# Altium schematic sheet hv_architecture.SchDoc
size B; SheetNumber: 3
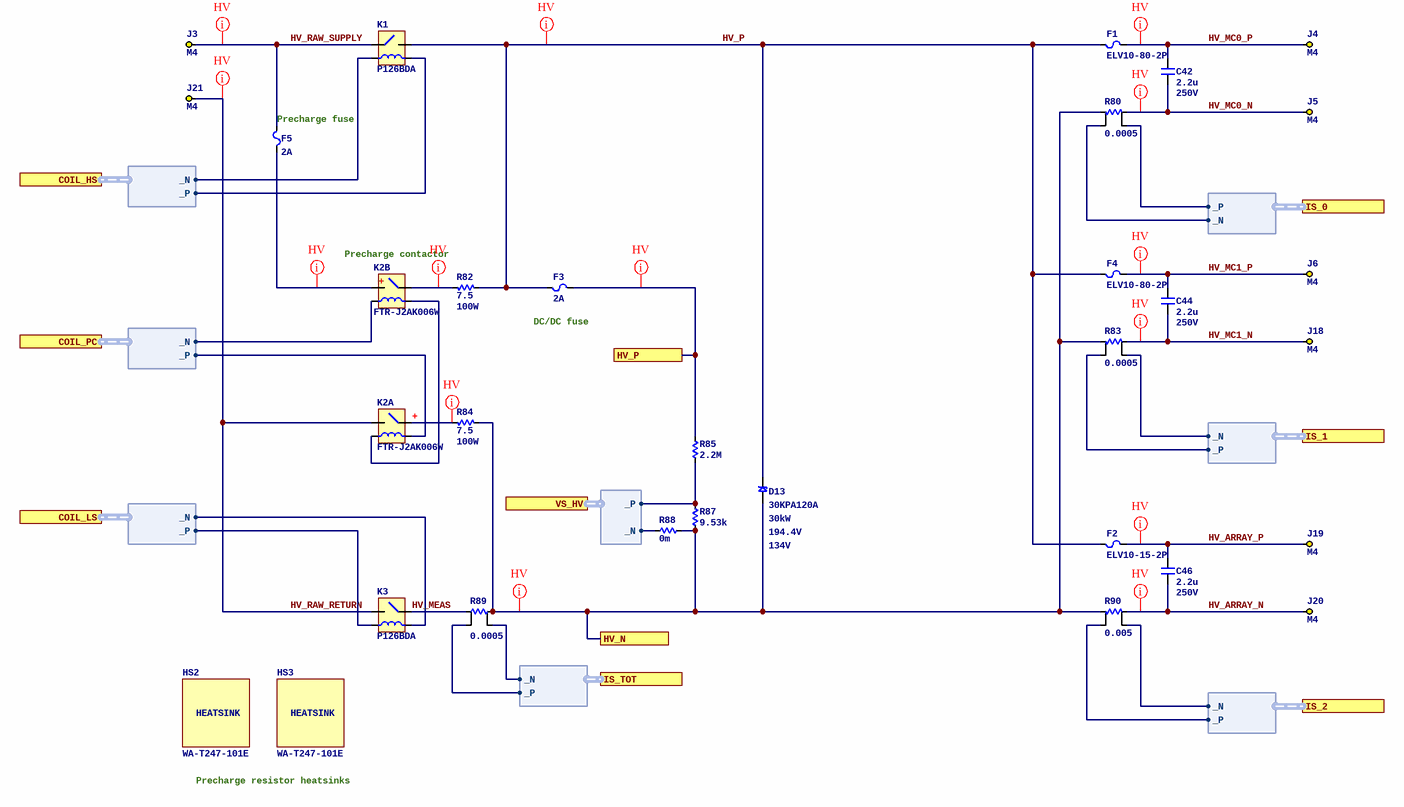
[diagram p0: hv_architecture.SchDoc]

## Parts
C42  Capacitance: 2.2u  Voltage Rating: 250V  [C2220]  (hidden comment: C5750X7T2E225KT000N)
C44  Capacitance: 2.2u  Voltage Rating: 250V  [C2220]  (hidden comment: C5750X7T2E225KT000N)
C46  Capacitance: 2.2u  Voltage Rating: 250V  [C2220]  (hidden comment: C5750X7T2E225KT000N)
D13  30KPA120A  Non-rep Peak Rev Power Dis-Max: 30kW  Clamping Voltage-Max: 194.4V  Min Breakdown Voltage: 134V  [P600_VERTICAL]
F1  ELV10-80-2P  [EATON_ELV10-xx-2P]
F2  ELV10-15-2P  [EATON_ELV10-xx-2P]
F3  Current: 2A  [BELFUSE_0ZRE0200FF]  (hidden comment: 0ZRE0200FF1A)
F4  ELV10-80-2P  [EATON_ELV10-xx-2P]
F5  Current: 2A  [BELFUSE_0ZRE0200FF]  (hidden comment: 0ZRE0200FF1A)
HS2  WA-T247-101E  (mechanical)
HS3  WA-T247-101E  (mechanical)
J3  Thread Size: M4  [WURTH_TERM_7461086]  (hidden comment: 7461086)
J4  Thread Size: M4  [WURTH_TERM_7461086]  (hidden comment: 7461086)
J5  Thread Size: M4  [WURTH_TERM_7461086]  (hidden comment: 7461086)
J6  Thread Size: M4  [WURTH_TERM_7461086]  (hidden comment: 7461086)
J18  Thread Size: M4  [WURTH_TERM_7461086]  (hidden comment: 7461086)
J19  Thread Size: M4  [WURTH_TERM_7461086]  (hidden comment: 7461086)
J20  Thread Size: M4  [WURTH_TERM_7461086]  (hidden comment: 7461086)
J21  Thread Size: M4  [WURTH_TERM_7461086]  (hidden comment: 7461086)
K1  P126BDA  [RELAY_P126]
K2  FTR-J2AK006W  [RELAY_FTR-J2]  (parts A,B of 2)
K3  P126BDA  [RELAY_P126]
R80  Resistance (Ohms): 0.0005  [VISHAY_WSL2726]  (hidden comment: WSL2726L5000FEB)
R82  Resistance (Ohms): 7.5  Power (Watts): 100W  [TO-247-2 w Ohmite heatsink]  (hidden comment: TEH100M7R50FE)
R83  Resistance (Ohms): 0.0005  [VISHAY_WSL2726]  (hidden comment: WSL2726L5000FEB)
R84  Resistance (Ohms): 7.5  Power (Watts): 100W  [TO-247-2 w Ohmite heatsink]  (hidden comment: RES_7.5_OHM_100W_1%_TO247)
R85  value 2.2M  [R1206]  (hidden comment: RC1206FR-072M2L)
R87  value 9.53k  [R0402]  (hidden comment: 0402WGF9531TCE)
R88  value 0m  [R0402]  (hidden comment: 0402WGF0000TCE)
R89  Resistance (Ohms): 0.0005  [VISHAY_WSL2726]  (hidden comment: WSL2726L5000FEB)
R90  Resistance (Ohms): 0.005  [VISHAY_WSL2726]  (hidden comment: WSL27265L000FEB)

## Ports
COIL_HS (harness DIFF), COIL_LS (harness DIFF), COIL_PC (harness DIFF), HV_N, HV_P, IS_0 (harness DIFF), IS_1 (harness DIFF), IS_2 (harness DIFF), IS_TOT (harness DIFF), VS_HV (harness DIFF)

## Harnesses
DIFF: _N, _P

## Nets
HV_ARRAY_N: C46.2 J20.0 R90.1
HV_ARRAY_P: C46.1 F2.2 J19.0
HV_MC0_N: C42.2 J5.0 R80.1
HV_MC0_P: C42.1 F1.2 J4.0
HV_MC1_N: C44.2 J18.0 R83.1
HV_MC1_P: C44.1 F4.2 J6.0
HV_MEAS: K3.4 R89.1
HV_N: D13.1 R80.2 R83.2 R84.2 R87.2 R88.2 R89.2 R90.2 ; port HV_N
HV_P: D13.2 F1.1 F2.1 F3.1 F4.1 K1.3 R82.2
HV_P: F3.2 R85.1 ; port HV_P  [a separate net that carries the same name]
HV_RAW_RETURN: J21.0 K2.6 K3.3
HV_RAW_SUPPLY: F5.1 J3.0 K1.4
NetF5_2: F5.2 K2.8
NetK1_1: K1.1 ; port COIL_HS._N
NetK1_2: K1.2 ; port COIL_HS._P
NetK2_1: K2.1 ; port COIL_PC._P
NetK2_2: K2.2 K2.3
NetK2_4: K2.4 ; port COIL_PC._N
NetK2_5: K2.5 R84.1
NetK2_7: K2.7 R82.1
NetK3_1: K3.1 ; port COIL_LS._N
NetK3_2: K3.2 ; port COIL_LS._P
NetR80_3: R80.3 ; port IS_0._P
NetR80_4: R80.4 ; port IS_0._N
NetR83_3: R83.3 ; port IS_1._N
NetR83_4: R83.4 ; port IS_1._P
NetR85_2: R85.2 R87.1 ; port VS_HV._P
NetR88_1: R88.1 ; port VS_HV._N
NetR89_3: R89.3 ; port IS_TOT._P
NetR89_4: R89.4 ; port IS_TOT._N
NetR90_3: R90.3 ; port IS_2._N
NetR90_4: R90.4 ; port IS_2._P

## Layout directives
net class HV: HV_ARRAY_N, HV_ARRAY_P, HV_MC0_N, HV_MC0_P, HV_MC1_N, HV_MC1_P, HV_N, HV_P, HV_RAW_RETURN, HV_RAW_SUPPLY, NetF5_2, NetK2_5, NetK2_7

## Notes on the sheet
- (near F5) Precharge fuse
- Precharge contactor
- (near F3) DC/DC fuse
- Precharge resistor heatsinks
- (in symbol HEATSINK_OHMITE_WA-T247-101E) HEATSINK
- (in symbol RELAY_FTR-J2AK006W, part A) +
- (in symbol RELAY_FTR-J2AK006W, part B) +

## Library data of the parts
C42 C44 C46 = C5750X7T2E225KT000N: Manufacturer: TDK; Dielectric: X7T; ComponentLink1URL: https://wmsc.lcsc.com/wmsc/upload/file/pdf/v2/lcsc/2304140030_TDK-C5750X7T2E225KT000N_C435266.pdf; ComponentLink1Description: Datasheet; Manufacturer Part Number: C5750X7T2E225KT000N; Package: 2220; Supplier 2: LCSC; Supplier Part Number 2: C435266
D13 = TVS_UNI_30KPA120A: Trans Voltage Suppressor Diode, 30000W, 120V V(RWM), Unidirectional, 1 Element, Silicon; Manufacturer: Littelfuse; Supplier 1: Digikey; Supplier Part Number 1: 30KPA120A-ND; Manufacturer Part Number: 30KPA120A; ComponentLink1URL: https://mm.digikey.com/Volume0/opasdata/d220001/medias/docus/4180/30KPA_Series.pdf; ComponentLink1Description: Datasheet; Supplier 2: LCSC; Supplier Part Number 2: C1984717
F1 F4 = FUSE_EATON_ELV10-80-2P: FUSE EV 80A 200VDC 2P TERM; Manufacturer: Eaton; Supplier 1: Digikey; Supplier Part Number 1: 283-ELV10-80-2P-ND; Manufacturer Part Number: ELV10-80-2P; ComponentLink1Description: Datasheet; ComponentLink1URL: https://www.eaton.com/content/dam/eaton/products/electronic-components/resources/data-sheet/eaton-elv10-10x25mm-ev-fuse-data-sheet-elx1302-en.pdf
F2 = FUSE_EATON_ELV10-15-2P: 15A 200 VDC Fuse Cartridge Through Hole; Manufacturer: Eaton; Supplier 1: Digikey; Supplier Part Number 1: 283-ELV10-15-2P-ND; Manufacturer Part Number: ELV10-15-2P; ComponentLink1Description: Datasheet; ComponentLink1URL: https://www.eaton.com/content/dam/eaton/products/electronic-components/resources/data-sheet/eaton-elv10-10x25mm-ev-fuse-data-sheet-elx1302-en.pdf
F3 F5 = PTC_BELFUSE_0ZRE0200FF1A: Polymeric PTC Resettable Fuse 240V 2 A Ih Through Hole Radial, Disc; Manufacturer: Bel Fuse Inc.; Supplier 1: Digikey; Supplier Part Number 1: 5923-0ZRE0200FF1A-ND; Manufacturer Part Number: 0ZRE0200FF1A; Supplier 2: LCSC; ComponentLink1Description: Datasheet; ComponentLink1URL: https://www.belfuse.com/media/datasheets/products/circuit-protection/ds-cp-0zre-series.pdf
HS2 HS3 = HEATSINK_OHMITE_WA-T247-101E: Heat Sink, 11ohm, Extruded, Clip, Longitudinal, Aluminum Alloy, Anodized; Manufacturer: Ohmite; Supplier 1: Digikey; Supplier Part Number 1: WA-T247-101E-ND; Manufacturer Part Number: WA-T247-101E; ComponentLink1Description: Datasheet; ComponentLink1URL: https://www.ohmite.com/assets/images/sink-w.pdf
J3-J6 J18-J21 = CONN_WURTH_7461086: POWER ELEMENT BUSH M4 12PIN; Manufacturer: Wurth Electronics; Supplier 1: Digikey; Supplier Part Number 1: 732-3207-ND; Manufacturer Part Number: 7461086
K1 K3 = RELAY_P126BDA: RELAY GEN PURPOSE SPST 60A 12V; Manufacturer: Sensata; Supplier 1: Digikey; Supplier Part Number 1: 3596-P126BDA-ND; Manufacturer Part Number: P126BDA; Supplier 2: Mouser; Supplier Part Number 2: 682-P126BDA; ComponentLink1Description: Datasheet; ComponentLink1URL: https://www.sensata.com/sites/default/files/a/sensata-gigavac-p126-series-minitactor-contactors-datasheet.pdf
K2 = RELAY_FTR-J2AK006W: General Purpose Relay 450VDC/10A; Manufacturer: Fujitsu; Supplier 1: Verical; Supplier Part Number 1: FTR-J2AK006W; Manufacturer Part Number: FTR-J2AK006W; ComponentLink1URL: https://www.fcl-components.com/downloads/MICRO/fcai/relays/ftr-j2.pdf; ComponentLink1Description: Datasheet; Supplier 2: Mouser; Supplier Part Number 2: 817-FTR-J2AK006W
R80 R83 R89 = RES_CURRENT_SENSE_0.0005_OHM_1%_3W_2726_WSL2726L5000FEB: RES SMD 0.0005 OHM 1% 3W 2726; Manufacturer: Vishay Dale; Supplier 1: Digikey; Manufacturer Part Number: WSL2726L5000FEB; ComponentLink1URL: http://www.vishay.com/docs/30131/wsl2726.pdf; ComponentLink1Description: Datasheet; Supplier Part Number 1: WSLQ-.0005CT-ND; Supplier 2: LCSC; Supplier Part Number 2: C4132421
R82 = RES_7.5_OHM_100W_1%_TO247: RES TK FM 7.5 OHM 100W 1% TO247; Manufacturer: Ohmite; Supplier 1: Digikey; Manufacturer Part Number: TEH100M7R50FE; ComponentLink1URL: http://www.ohmite.com/cat/res_teh100.pdf; ComponentLink1Description: Datasheet; Supplier Part Number 1: TEH100M7R50FE-ND; Supplier 2: LCSC; Supplier Part Number 2: C2641795
R84 = RES_7.5_OHM_100W_1%_TO247: RES TK FM 7.5 OHM 100W 1% TO247; Manufacturer: Ohmite; Manufacturer Part Number: TEH100M7R50FE; Supplier 1: Digikey; ComponentLink1URL: http://www.ohmite.com/cat/res_teh100.pdf; ComponentLink1Description: Datasheet; Supplier Part Number 1: TEH100M7R50FE-ND; Supplier 2: LCSC; Supplier Part Number 2: C2641795
R85 = RC1206FR-072M2L: Manufacturer: YAGEO; Tolerance: 1%; Temperature Coefficient: Â±100ppm/â„ƒ; Power Rating (mW): 250; ComponentLink1Description: Datasheet; ComponentLink1URL: https://wmsc.lcsc.com/wmsc/upload/file/pdf/v2/lcsc/2304140030_YAGEO-RC1206FR-072M2L_C137329.pdf; Manufacturer Part Number: RC1206FR-072M2L; Package: 1206; Supplier 2: LCSC; Supplier Part Number 2: C137329
R87 = 0402WGF9531TCE: Manufacturer: UNI-ROYAL(Uniroyal Elec); Tolerance: 1%; Temperature Coefficient: Â±100ppm/â„ƒ; Power Rating (mW): 62.5; ComponentLink1Description: Datasheet; ComponentLink1URL: https://wmsc.lcsc.com/wmsc/upload/file/pdf/v2/lcsc/2205312316_UNI-ROYAL-Uniroyal-Elec-0402WGF9531TCE_C96273.pdf; Manufacturer Part Number: 0402WGF9531TCE; Package: 0402; Supplier 2: LCSC; Supplier Part Number 2: C96273
R88 = 0402WGF0000TCE: Manufacturer: UNI-ROYAL(Uniroyal Elec); Power Rating (mW): 62.5; ComponentLink1Description: Datasheet; ComponentLink1URL: https://wmsc.lcsc.com/wmsc/upload/file/pdf/v2/lcsc/2206010216_UNI-ROYAL-Uniroyal-Elec-0402WGF0000TCE_C17168.pdf; Manufacturer Part Number: 0402WGF0000TCE; Package: 0402; Supplier 2: LCSC; Supplier Part Number 2: C17168
R90 = RES_CURRENT_SENSE_0.005_OHM_1%_3W_2726_WSL27265L000FEB: RES SMD 0.005 OHM 1% 3W 2726; Manufacturer: Vishay Dale; Supplier 1: Digikey; Manufacturer Part Number: WSL27265L000FEB; ComponentLink1URL: http://www.vishay.com/docs/30131/wsl2726.pdf; ComponentLink1Description: Datasheet; Supplier Part Number 1: WSLQ-.005CT-ND; Supplier 2: LCSC; Supplier Part Number 2: C1517421